# EAGLE design LockDriver (EAGLE 7.1.0)
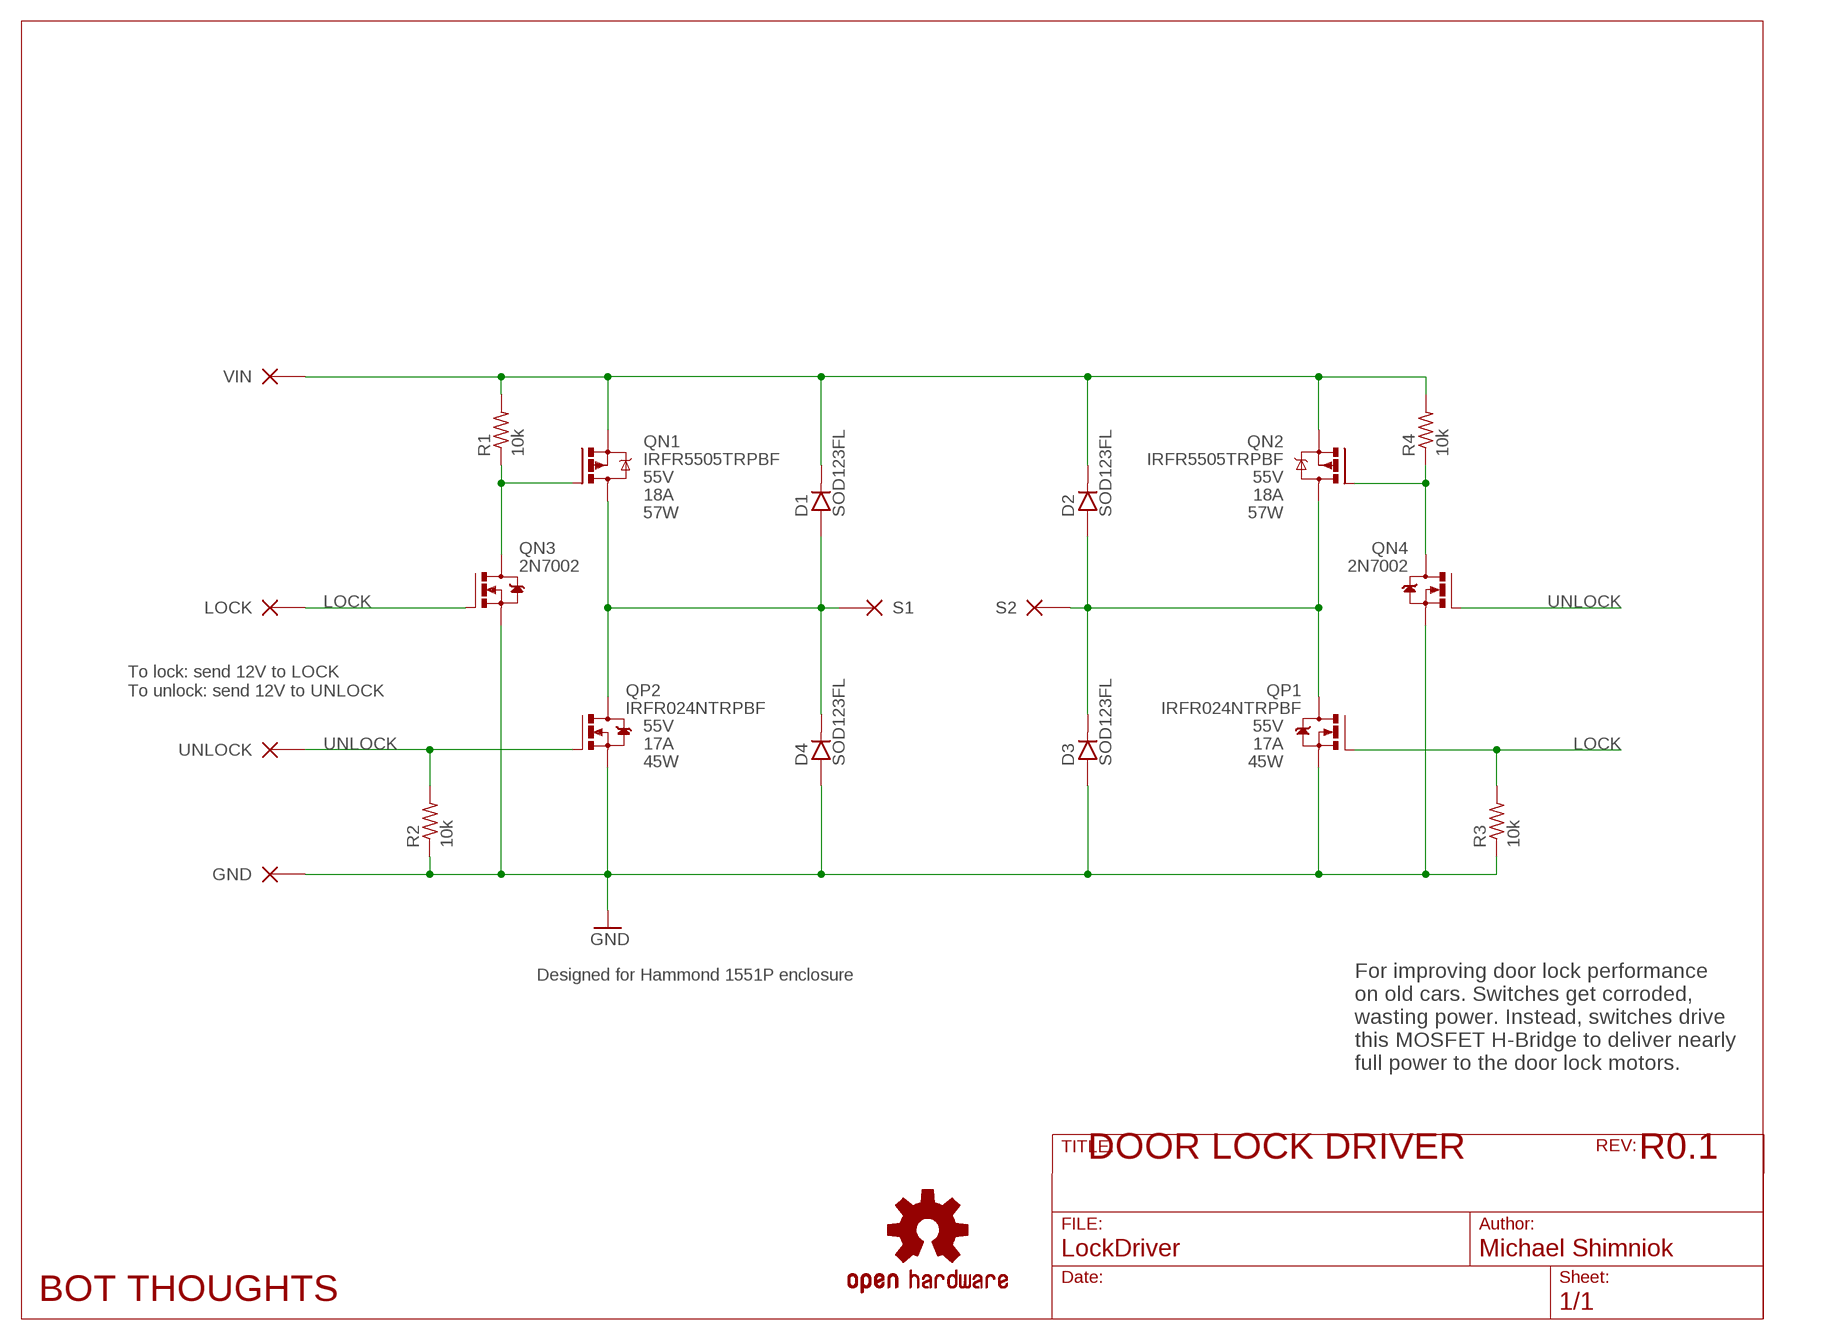
[diagram p0: schematic, sheet 1]

## Parts
D1  SOD123FL  DIODE_SOD123FL  [SOD123FL]
D2  SOD123FL  DIODE_SOD123FL  [SOD123FL]
D3  SOD123FL  DIODE_SOD123FL  [SOD123FL]
D4  SOD123FL  DIODE_SOD123FL  [SOD123FL]
LOGO1  OSHW-LOGOS  [OSHW-LOGO-S]
QN1  IRFR5505TRPBF  MOSFET-PTO252  [TO252]
QN2  IRFR5505TRPBF  MOSFET-PTO252  [TO252]
QN3  2N7002  MOSFET-N.SOT23  [SOT-23]
QN4  2N7002  MOSFET-N.SOT23  [SOT-23]
QP1  IRFR024NTRPBF  MOSFET-NTO252  [TO252]
QP2  IRFR024NTRPBF  MOSFET-NTO252  [TO252]
R1  10k  R-US_R0603  [R0603]
R2  10k  R-US_R0603  [R0603]
R3  10k  R-US_R0603  [R0603]
R4  10k  R-US_R0603  [R0603]
U$2  BOT-THOUGHTSLOGO_M  [BTLOGOM]
X1  S1  WIREPAD_14GA  [PAD_14GA]
X2  S2  WIREPAD_14GA  [PAD_14GA]
X3  VIN  WIREPAD_12GA  [PAD_12GA]
X4  GND  WIREPAD_12GA  [PAD_12GA]
X5  LOCK  WIREPAD_18GA  [PAD_18GA]
X6  UNLOCK  WIREPAD_18GA  [PAD_18GA]

## Nets
12V: D1.C D2.C QN1.2(S) QN2.2(S) R1.2 R4.2 X3.P$1(P)
GND: D3.A D4.A QN3.2(S) QN4.2(S) QP1.2(S) QP2.2(S) R2.1 R3.1 X4.P$1(P)
LOCK: QN3.1(G) QP1.1(G) R3.2 X5.P$1(P)
M1: D1.A D4.C QN1.3(D) QP2.3(D) X1.P$1(P)
M2: D2.A D3.C QN2.3(D) QP1.3(D) X2.P$1(P)
N$1: QN1.1(G) QN3.3(D) R1.1
N$2: QN2.1(G) QN4.3(D) R4.1
UNLOCK: QN4.1(G) QP2.1(G) R2.2 X6.P$1(P)

## Notes on the sheet
- To lock: send 12V to LOCK
  To unlock: send 12V to UNLOCK
- Designed for Hammond 1551P enclosure
- For improving door lock performance
  on old cars. Switches get corroded,
  wasting power. Instead, switches drive
  this MOSFET H-Bridge to deliver nearly
  full power to the door lock motors.
- DOOR LOCK DRIVER | R0.1

## Library data of the parts
D1-D4 = bt_diode:DIODE: Diode Collection of generic diodes in various packages
LOGO1 = SparkFun-Aesthetics:OSHW-LOGO: Open-Source Hardware (OSHW) Logo This logo indicates the piece of hardware it is found on incorporates a OSHW license and/or adheres to the definition of open source hardware found here: http://freedomdefined.org/OSHW
QN1 QN2 = ads4:MOSFET-P: P-Channel MOSFET with integrated body diode; CURRENT: 18A; POWER: 57W; VOLTAGE: 55V
QN3 QN4 = ads4:MOSFET-N: N-Channel MOSFET
QP1 QP2 = ads4:MOSFET-N: N-Channel MOSFET; CURRENT: 17A; POWER: 45W; VOLTAGE: 55V
R1-R4 = rcl:R-US_: RESISTOR, American symbol
U$2 = bt:BOT-THOUGHTS
X1-X6 = bt_electromech:WIREPAD: PIN PAD Generic pin pad / wire pad / wirepad connector

## Board
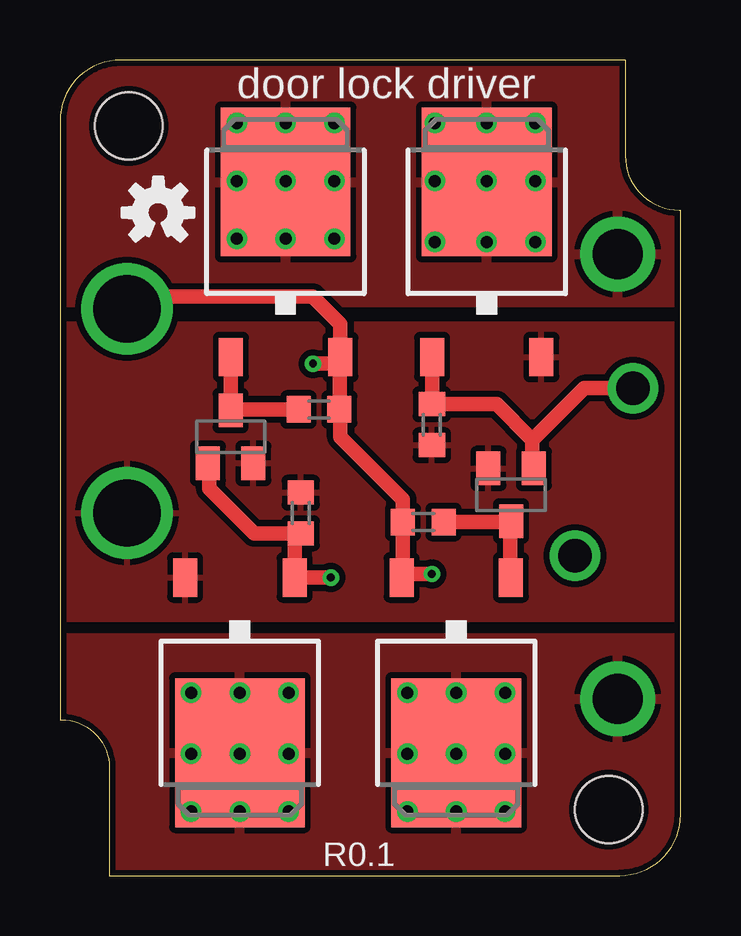
[diagram p1: board, top side]
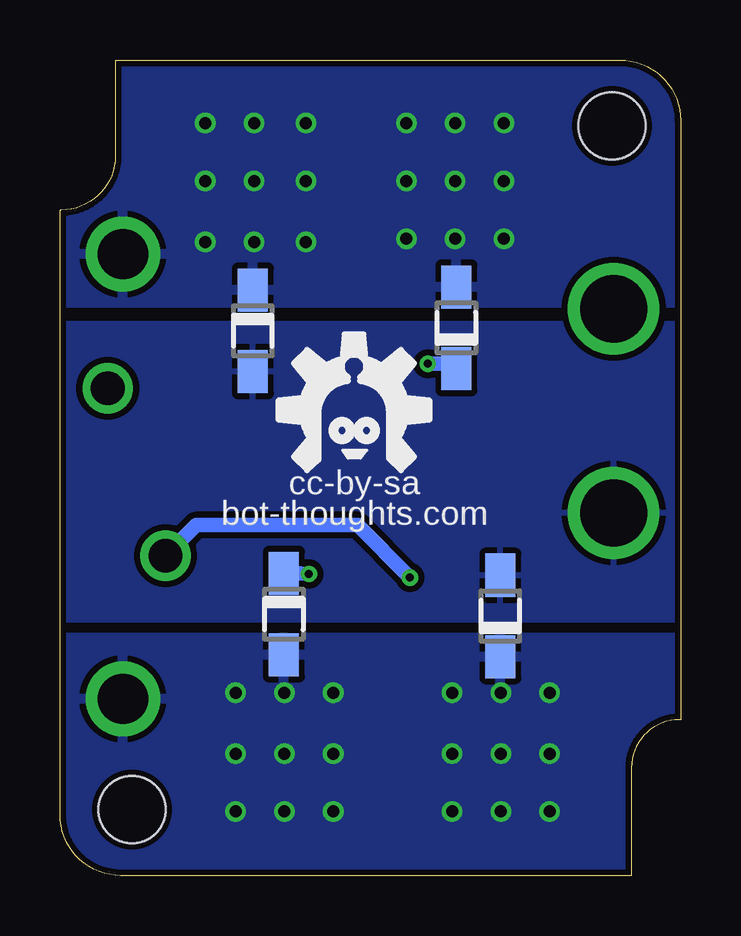
[diagram p2: board, bottom side, seen from below]

Size 25.86 x 34 mm. Coordinates in mm from the lower left corner, seen from the top.
Copper layers (1*16): Top 0.0356mm / dielectric 1.5011mm / Bottom 0.0356mm
Design rules "LaenPCBOrder": minimum track width 6mil, minimum drill 13mil, track to track 10mil, track to pad 10mil, pad to pad 10mil, via to via 10mil, smd to smd 8mil, copper to edge 10mil, drill to drill 10mil, minimum pad ring 7mil, minimum via ring 7mil, stop-mask expansion 3mil, vias tented up to drill 20mil, thermal gap 10mil

### Footprints (pad centres in the part's own frame; a part is rotated, then mirrored left to right if it is on the bottom)
SOD123FL = smd 1.8 x 1.25: A 1.7,0; C -1.7,0
TO252 = smd 1 x 1.6: 1 -2.28,-4.8; 2 2.28,-4.8 | smd 5.4 x 6.2: 3 0,2.5
SOT-23 = smd 1 x 1.4: 1 -0.95,-1.1; 2 0.95,-1.1; 3 0,1.1
R0603 = smd 1 x 1.1: 1 -0.85,0; 2 0.85,0
HAMMOND1551P = hole 2.8: 2.865,31.25; 22.865,2.75
PAD_14GA = drill 2.1: P$1 0,0
PAD_12GA = drill 2.8: P$1 0,0
PAD_18GA = drill 1.4: P$1 0,0

### Placement (x,y rotation side)
D1  9.35,22.83 90 bottom
D2  16.54,10.9 270 bottom
D3  7.52,10.82 90 bottom
D4  17.83,22.71 270 bottom
LOGO1  4.09,27.64 0 top
QN1  9.4,26.42 0 top
QN2  16.51,7.62 180 top
QN3  7.11,18.29 0 top
QN4  18.8,15.88 180 top
QP1  7.49,7.62 180 top
QP2  17.78,26.42 0 top
R1  10.79,19.43 0 top
R2  15.49,18.8 90 top
R3  10.03,15.11 270 top
R4  15.14,14.73 180 top
U$1  [HAMMOND1551P]  0,0 0 top
U$2  13.61,19.43 0 bottom
X1  23.24,25.91 270 top
X2  23.24,7.37 180 top
X3  2.79,23.62 270 top
X4  2.79,15.11 270 top
X5  21.46,13.34 90 top
X6  23.88,20.32 270 top

### Tracks (layer width: path | path; a pad name or v marks a point on that pad's centre or on a via)
12V  (via drill 0.33)
  Top 0.61: v15.49,12.57 14.33,12.57 QN2.2 14.29,12.48 R4.2 14.29,15.68 11.68,18.29 11.68,19.39 R1.2 11.65,19.68 11.65,21.34 | v10.54,21.34 11.65,21.34 | 11.65,21.34 QN1.2 11.68,22.99 10.54,24.13 3.3,24.13 X3.P$1
  Bottom 0.61: D2.C 15.85,12.6 v15.49,12.57 | 9.45,21.14 D1.C 9.58,21.14 9.78,21.34 v10.54,21.34
GND
  pour Top (rank 4): 0,22.99 25.91,22.99 25.91,10.67 0,10.67
  pour Bottom: 0,22.99 25.91,22.99 25.91,10.67 0,10.67
LOCK  (via drill 0.33)
  Top 0.61: QN3.1 6.22,17.13 6.22,16.13 8.09,14.26 R3.2 10.03,14.22 9.78,13.97 QP1.1 | QP1.1 | QP1.1 v11.28,12.43
  Bottom 0.61: v11.28,12.43 13.46,14.61 20.19,14.61 X5.P$1
M1  (via drill 0.5)
  other vias: 19.81,26.42 17.78,26.42 7.37,28.96 7.37,31.37 15.62,31.37 15.62,26.42 19.81,31.37 17.78,31.37 11.43,31.37 9.4,31.37 7.37,26.54 11.43,26.54 9.4,26.54 9.4,28.96 11.43,28.96 15.62,28.96 19.81,28.96 17.78,28.96
  pour Top: 0,34.04 25.78,34.04 25.78,23.88 0,23.88
  pour Bottom: 0,34.04 25.78,34.04 25.78,23.88 0,23.88
M2  (via drill 0.5)
  other vias: 9.53,7.62 7.49,2.67 9.53,2.67 5.46,2.67 5.46,7.62 9.53,5.08 7.49,5.08 7.49,7.62 5.46,5.08 14.48,7.62 18.54,7.62 18.54,2.67 14.48,2.67 14.48,5.08 16.51,2.67 16.51,7.62 18.54,5.08 16.51,5.08
  pour Top: 0,9.91 25.91,9.91 25.91,0 0,0
  pour Bottom: 0,9.91 25.91,9.91 25.91,0 0,0
N$1
  Top 0.61: R1.1 7.16,19.43 QN3.3 QN1.1
N$2
  Top 0.61: R4.1 18.75,14.73 | 18.75,14.73 QN4.3 | 18.75,14.73 18.75,12.46 QN2.1
UNLOCK
  Top 0.61: 19.68,18.16 18.2,19.65 R2.2 QP2.1 | 19.68,18.16 19.68,17.04 QN4.1 | X6.P$1 21.84,20.32 19.68,18.16

### Text on the board
tNames: door lock driver | R0.1
bNames: cc-by-sa | bot-thoughts.com